# Altium schematic sheet DC-link-Caps.SchDoc
size A4; CompanyName: Technische Hochschule Nürnberg Georg Simon Ohm; Organization: UltraZohm; Address1: Kesslerplatz 12; Address2: 90489 Nürnberg; Address3: GERMANY; SheetNumber: 8; SheetTotal: 8; Website: www.ultrazohm.com
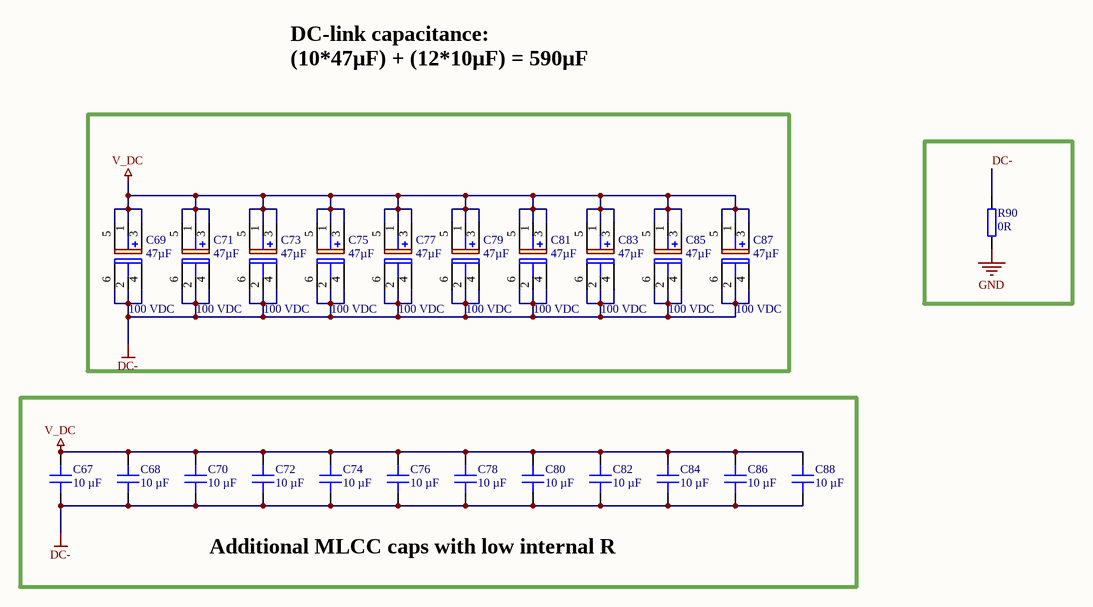
[diagram p0: DC-link-Caps.SchDoc]

## Parts
C67  10 µF  [C_1210_N]
C68  10 µF  [C_1210_N]
C69  47µF  Voltage Rating: 100 VDC  [EEEFK0J332AV]
C70  10 µF  [C_1210_N]
C71  47µF  Voltage Rating: 100 VDC  [EEEFK0J332AV]
C72  10 µF  [C_1210_N]
C73  47µF  Voltage Rating: 100 VDC  [EEEFK0J332AV]
C74  10 µF  [C_1210_N]
C75  47µF  Voltage Rating: 100 VDC  [EEEFK0J332AV]
C76  10 µF  [C_1210_N]
C77  47µF  Voltage Rating: 100 VDC  [EEEFK0J332AV]
C78  10 µF  [C_1210_N]
C79  47µF  Voltage Rating: 100 VDC  [EEEFK0J332AV]
C80  10 µF  [C_1210_N]
C81  47µF  Voltage Rating: 100 VDC  [EEEFK0J332AV]
C82  10 µF  [C_1210_N]
C83  47µF  Voltage Rating: 100 VDC  [EEEFK0J332AV]
C84  10 µF  [C_1210_N]
C85  47µF  Voltage Rating: 100 VDC  [EEEFK0J332AV]
C86  10 µF  [C_1210_N]
C87  47µF  Voltage Rating: 100 VDC  [EEEFK0J332AV]
C88  10 µF  [C_1210_N]
R90  0R  [RES 0603_1608]

## Nets
DC-: C67.1 C68.1 C69.2(-_1) C69.4(+_3) C69.6(-_3) C70.1 C71.2(-_1) C71.4(+_3) C71.6(-_3) C72.1 C73.2(-_1) C73.4(+_3) C73.6(-_3) C74.1 C75.2(-_1) C75.4(+_3) C75.6(-_3) C76.1 C77.2(-_1) C77.4(+_3) C77.6(-_3) C78.1 C79.2(-_1) C79.4(+_3) C79.6(-_3) C80.1 C81.2(-_1) C81.4(+_3) C81.6(-_3) C82.1 C83.2(-_1) C83.4(+_3) C83.6(-_3) C84.1 C85.2(-_1) C85.4(+_3) C85.6(-_3) C86.1 C87.2(-_1) C87.4(+_3) C87.6(-_3) C88.1 R90.1
GND: R90.2
V_DC: C67.2 C68.2 C69.1(+_1) C69.3(+_2) C69.5(-_2) C70.2 C71.1(+_1) C71.3(+_2) C71.5(-_2) C72.2 C73.1(+_1) C73.3(+_2) C73.5(-_2) C74.2 C75.1(+_1) C75.3(+_2) C75.5(-_2) C76.2 C77.1(+_1) C77.3(+_2) C77.5(-_2) C78.2 C79.1(+_1) C79.3(+_2) C79.5(-_2) C80.2 C81.1(+_1) C81.3(+_2) C81.5(-_2) C82.2 C83.1(+_1) C83.3(+_2) C83.5(-_2) C84.2 C85.1(+_1) C85.3(+_2) C85.5(-_2) C86.2 C87.1(+_1) C87.3(+_2) C87.5(-_2) C88.2

## Notes on the sheet
- DC-link capacitance:
  (10*47µF) + (12*10µF) = 590µF
- Additional MLCC caps with low internal R
- Title
- Revision:
- Design Engineer:
- Date:
- Project:
- Sheet
- of

## Library data of the parts
C67 C68 C70 C72 C74 C76 C78 C80 C82 C84 C86 C88 = GRM32EC72A106KE05L: Capacitor 1210, 100 VDC, 10µF, X7S; Manufacturer: Murata Electronics; Tolerance: 10 %; Voltage Rating: 100 VDC; Created from: DHufnagel; Manufacturer Part Number: GRM32EC72A106KE05L; PartID: 118; Created On: 12/21/2022 2:25:08 PM; ComponentLink1Description: Datasheet; ComponentLink1URL: https://www.mouser.de/datasheet/2/281/1/GRM32EC72A106KE05_01A-1988109.pdf; Component Type: Capacitor 1210; Device Package: 1210; Last Updated: 7/5/2023 6:12:15 PM; Mounting Type: SMD; Operating Temperature: -55 - 125°C; Series: GRM; Supplier 1: Mouser; Supplier Part Number 1: 81-GRM32EC72A106KE05; Type: Capacitor; Value: 10 µF; Live Cycle Status: 1; Stock number: not stored; LCSC Part Number: C576517
C69 C71 C73 C75 C77 C79 C81 C83 C85 C87 = EEEFK2A470AQ: 13.8x12.5x13.8mm, 100 VDC,  47 µF; Manufacturer: Panasonic; Type: Capacitor_Polarized; Tolerance: 20 %; Created from: KIlhan; Manufacturer Part Number: EEEFK2A470AQ; PartID: 126; Created On: 6/20/2023 11:44:24 AM; ComponentLink1Description: Datasheet; ComponentLink1URL: https://eu.mouser.com/datasheet/2/315/ABA0000C1178-947398.pdf; Component Type: Capacitor Al Electrolyt; Device Package: H13; Last Updated: 7/5/2023 4:09:36 PM; Mounting Type: SMD; Operating Temperature: -55 - 105°C; Series: FK-V_A Medium; Supplier 1: Mouser; Supplier Part Number 1: 667-EEE-FK2A470AQ; Value: 47µF; Live Cycle Status: 1; Stock number: not stored; LCSC Part Number: C401732
R90 = RC0603JR-070RL: SMD resistor E24 series; Manufacturer: YAGEO; Tolerance: 5%; Created from: MGremer; Manufacturer Part Number: RC0603JR-070RL; PartID: 1; Created On: 12/14/2020 4:17:14 PM; ComponentLink1Description: Datasheet; ComponentLink1URL: https://www.mouser.de/datasheet/2/447/PYu-RC_Group_51_RoHS_L_10-1664068.pdf; Component Type: SMD resistor; Device Package: 0603; Last Updated: 3/4/2021 9:09:42 AM; Mounting Type: SMD; Supplier 1: Mouser; Supplier Part Number 1: 603-RC0603JR-070RL; Type: Resistor; Value: 0R; Live Cycle Status: 1; Stock number: Labor SMD Container; LCSC Part Number: C21189; Supplier 2: LCSC; Supplier Part Number 2: C21189